# EAGLE design mach (EAGLE 6.1)
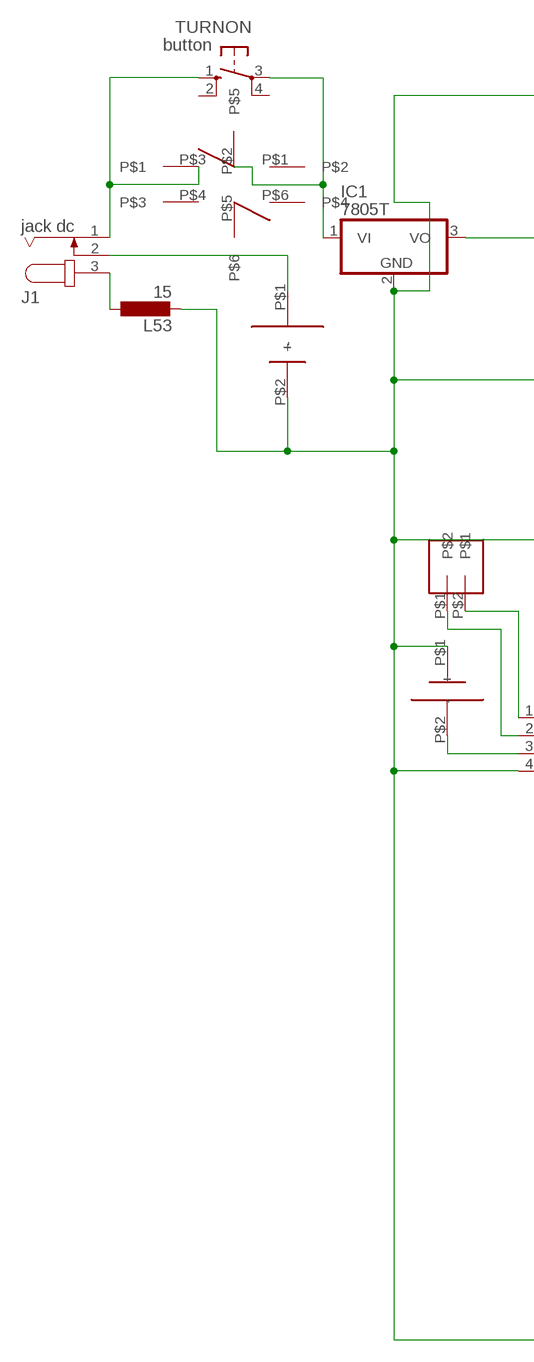
[diagram p0: schematic, sheet 1, part 1 of 2]
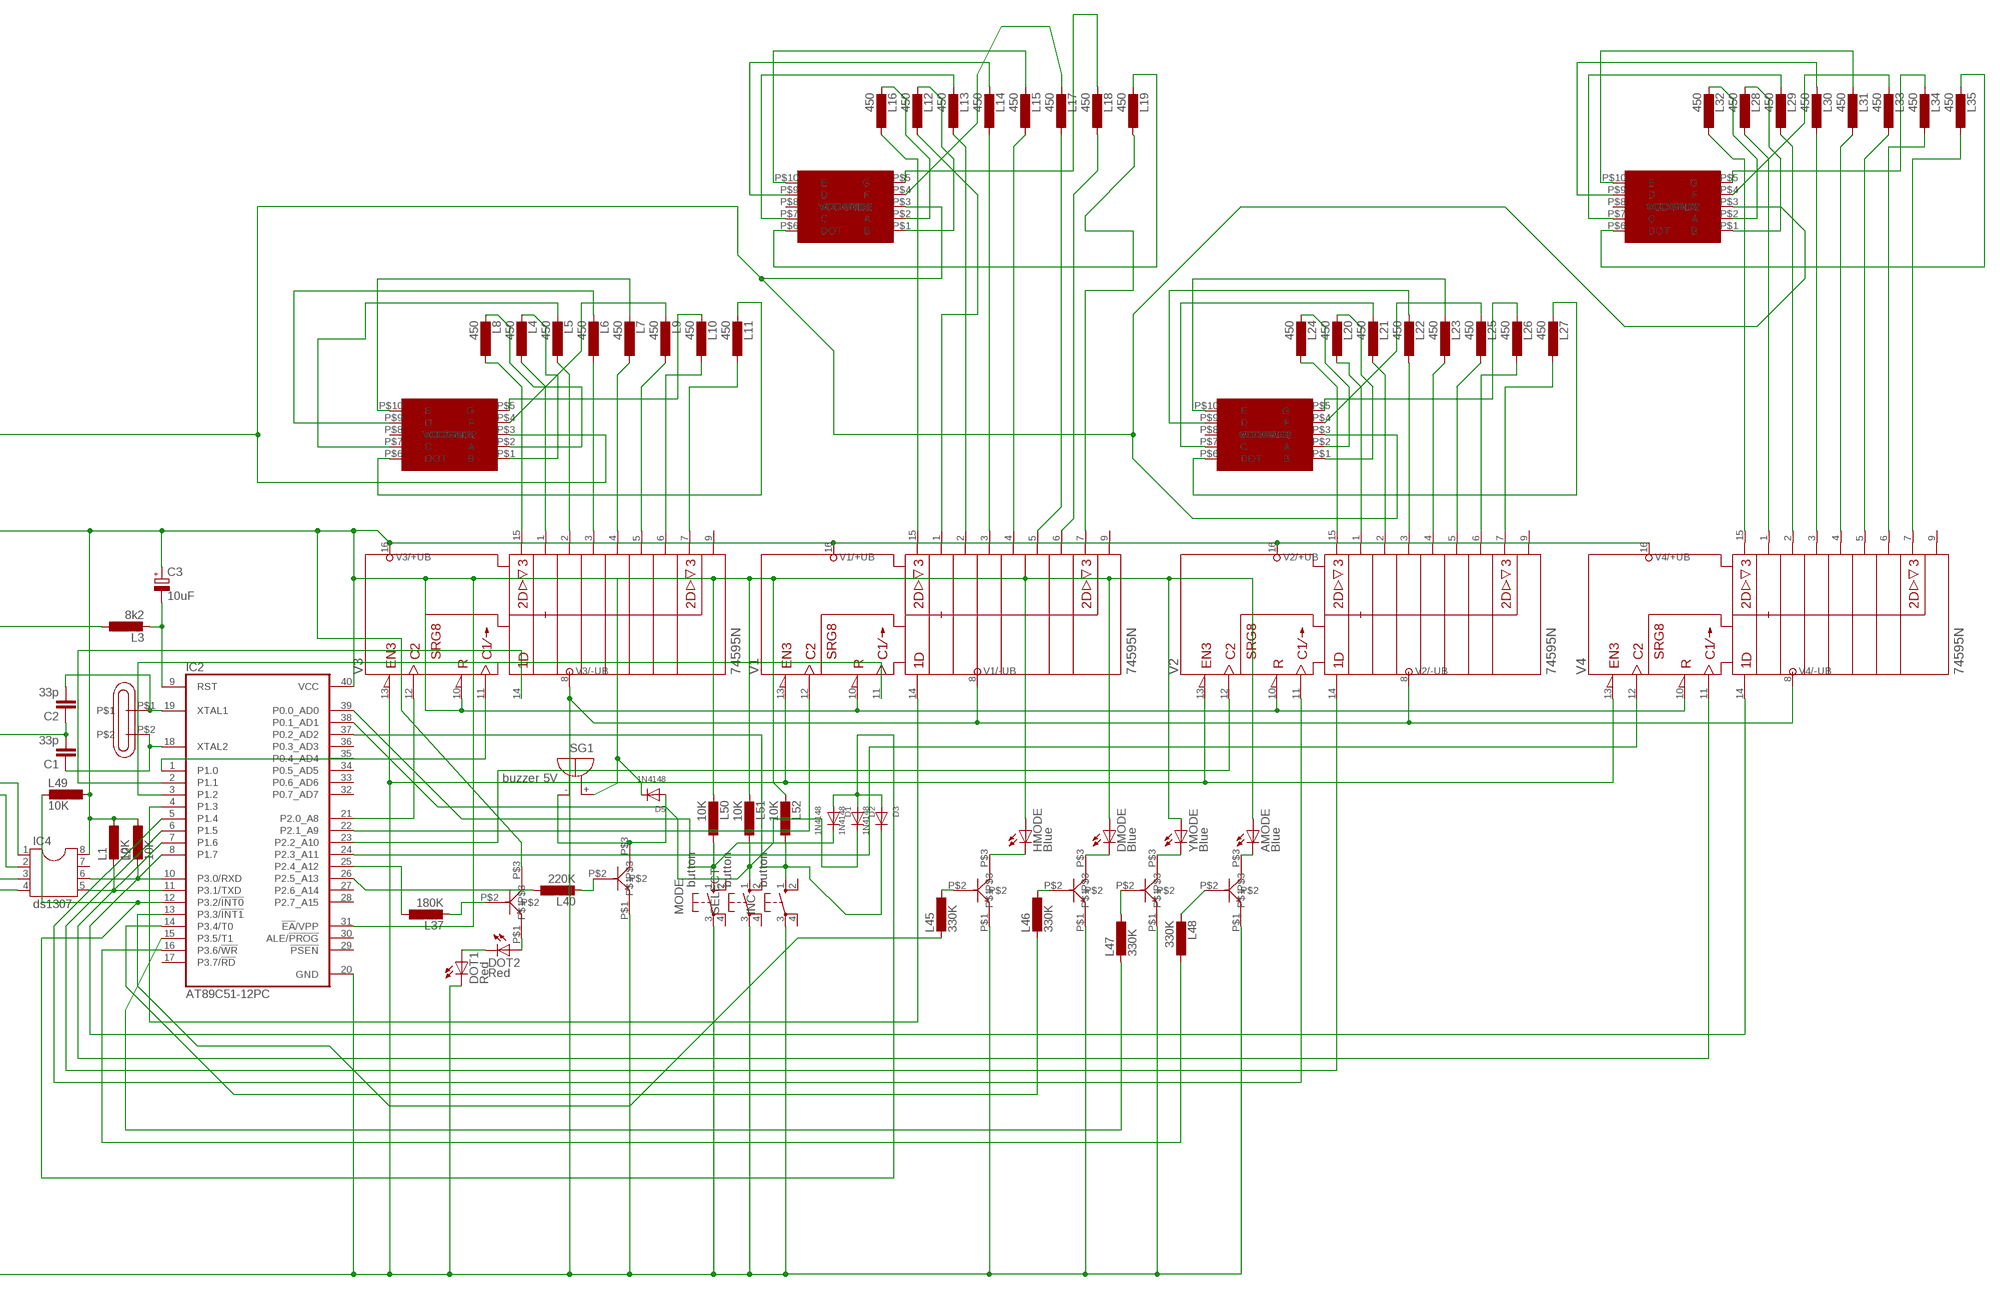
[diagram p1: schematic, sheet 1, part 2 of 2]

## Parts
7SEG1  7SEG13X19 common Katot  7SEG13X19  [7SEG13X19]
7SEG2  7SEG13X19 common Katot  7SEG13X19  [7SEG13X19]
7SEG3  7SEG13X19 common Katot  7SEG13X19  [7SEG13X19]
7SEG4  7SEG13X19 common Katot  7SEG13X19  [7SEG13X19]
AMODE  Blue  LED5MM  [LED5MM]
C1  33p  C5/3  [C5B3]
C2  33p  C5/3  [C5B3]
C3  10uF  CPOL-EUE2-5  [E2-5]
D1  1N4148  DIODEDO-1N4148  [DO-1N4148]
D2  1N4148  DIODEDO-1N4148  [DO-1N4148]
D3  1N4148  DIODEDO-1N4148  [DO-1N4148]
D5  1N4148  DIODEDO-1N4148  [DO-1N4148]
DMODE  Blue  LED5MM  [LED5MM]
DOT1  Red  LED5MM  [LED5MM]
DOT2  Red  LED5MM  [LED5MM]
HMODE  Blue  LED5MM  [LED5MM]
IC1  7805T  [TO220H]
IC2  AT89C51-12PC  [DIL40]
IC4  ds1307  DIL8  [DIL08]
INC  button  10-XX  [B3F-10XX]
J1  jack dc  JACK-PLUG0  [SPC4077]
L1  10K  L-EU0207/10  [0207/10]
L2  10K  L-EU0207/10  [0207/10]
L3  8k2  L-EU0207/10  [0207/10]
L4  450  L-EU0207/10  [0207/10]
L5  450  L-EU0207/10  [0207/10]
L6  450  L-EU0207/10  [0207/10]
L7  450  L-EU0207/10  [0207/10]
L8  450  L-EU0207/10  [0207/10]
L9  450  L-EU0207/10  [0207/10]
L10  450  L-EU0207/10  [0207/10]
L11  450  L-EU0207/10  [0207/10]
L12  450  L-EU0207/10  [0207/10]
L13  450  L-EU0207/10  [0207/10]
L14  450  L-EU0207/10  [0207/10]
L15  450  L-EU0207/10  [0207/10]
L16  450  L-EU0207/10  [0207/10]
L17  450  L-EU0207/10  [0207/10]
L18  450  L-EU0207/10  [0207/10]
L19  450  L-EU0207/10  [0207/10]
L20  450  L-EU0207/10  [0207/10]
L21  450  L-EU0207/10  [0207/10]
L22  450  L-EU0207/10  [0207/10]
L23  450  L-EU0207/10  [0207/10]
L24  450  L-EU0207/10  [0207/10]
L25  450  L-EU0207/10  [0207/10]
L26  450  L-EU0207/10  [0207/10]
L27  450  L-EU0207/10  [0207/10]
L28  450  L-EU0207/10  [0207/10]
L29  450  L-EU0207/10  [0207/10]
L30  450  L-EU0207/10  [0207/10]
L31  450  L-EU0207/10  [0207/10]
L32  450  L-EU0207/10  [0207/10]
L33  450  L-EU0207/10  [0207/10]
L34  450  L-EU0207/10  [0207/10]
L35  450  L-EU0207/10  [0207/10]
L37  180K  L-EU0207/10  [0207/10]
L40  220K  L-EU0207/10  [0207/10]
L45  330K  L-EU0207/10  [0207/10]
L46  330K  L-EU0207/10  [0207/10]
L47  330K  L-EU0207/10  [0207/10]
L48  330K  L-EU0207/10  [0207/10]
L49  10K  L-EU0207/10  [0207/10]
L50  10K  L-EU0207/10  [0207/10]
L51  10K  L-EU0207/10  [0207/10]
L52  10K  L-EU0207/10  [0207/10]
L53  15  L-EU0207/10  [0207/10]
MODE  button  10-XX  [B3F-10XX]
SELECT  button  10-XX  [B3F-10XX]
SG1  buzzer 5V  BMT1205XH7.5  [BMT1205XH7.5]
TURNON  button  10-XX  [B3F-10XX]
U$1  PINCMOS3VCR23  [PINCMOS3VCR23]
U$2  XTAL32KHZMINI  [XTAL32KHZMINI]
U$5  XTAL12MHZ  [XTAL12MHZ]
U$7  lock button down  PUSHLOCKBUTON  [PUSKLOCKBUTTON]
U$8  C9014  [C9014]
U$9  C9014  [C9014]
U$10  C9014  [C9014]
U$11  C9014  [C9014]
U$12  C9014  [C9014]
U$13  C9014  [C9014]
U$14  9V  9VBATERYJACK  [9VBATERYJACK]
V1  74595N  [DIL16]
V2  74595N  [DIL16]
V3  74595N  [DIL16]
V4  74595N  [DIL16]
YMODE  Blue  LED5MM  [LED5MM]

## Nets
ET: J1.2 U$14.P$1(+)
GND: 7SEG1.P$3(VCC/GND1) 7SEG2.P$3(VCC/GND1) 7SEG3.P$3(VCC/GND1) 7SEG4.P$3(VCC/GND1) C1.2 C2.1 DOT1.K(C) IC1.2(GND) IC2.20(GND) IC4.4 INC.3(P) L3.1 L53.2 MODE.3(P) SELECT.3(P) U$1.P$1(-) U$8.P$1 U$9.P$1 U$10.P$1 U$11.P$1 U$12.P$1 U$14.P$2(-) V1.8(-UB) V1.13(!G) V2.8(-UB) V2.13(!G) V3.8(-UB) V3.13(!G) V4.8(-UB) V4.13(!G)
N$1: IC2.11(P3.1/TXD) IC4.5 L1.2
N$2: IC2.10(P3.0/RXD) IC4.6 L2.2
N$3: IC4.1 U$2.P$2
N$4: C3.- IC2.9(RST) L3.2
N$5: IC4.3 U$1.P$2(+)
N$6: IC4.2 U$2.P$1
N$7: C2.2 IC2.19(XTAL1) U$5.P$1
N$8: C1.1 IC2.18(XTAL2) U$5.P$2
N$9: D1.C IC2.39(P0.0_AD0) L50.1 MODE.1(S)
N$10: IC2.25(P2.4_A12) L37.1
N$11: IC2.1(P1.0) V3.11(SRCK)
N$12: IC2.2(P1.1) V3.14(SER)
N$13: IC2.3(P1.2) V1.11(SRCK)
N$14: DOT2.A U$13.P$1
N$15: IC2.5(P1.4) V2.11(SRCK)
N$16: 7SEG1.P$4(F) L9.2
N$17: IC2.6(P1.5) V2.14(SER)
N$18: IC2.7(P1.6) V4.11(SRCK)
N$19: IC2.8(P1.7) V4.14(SER)
N$20: L4.1 V3.1(QB)
N$21: L8.1 V3.15(QA)
N$22: 7SEG1.P$10(E) L7.2
N$23: L9.1 V3.5(QF)
N$24: L10.1 V3.6(QG)
N$25: 7SEG1.P$1(B) L4.2
N$26: L11.1 V3.7(QH)
N$27: L6.1 V3.3(QD)
N$28: L7.1 V3.4(QE)
N$29: L5.1 V3.2(QC)
N$30: DOT1.A DOT2.K(C)
N$31: J1.1 TURNON.1(S) U$7.P$3
N$32: 7SEG1.P$5(G) L10.2
N$33: IC2.4(P1.3) V1.14(SER)
N$34: 7SEG1.P$6(DOT) L11.2
N$35: IC1.1(VI) TURNON.3(P) U$7.P$2
N$36: 7SEG2.P$10(E) L15.2
N$37: L13.1 V1.2(QC)
N$38: L14.1 V1.3(QD)
N$39: L15.1 V1.4(QE)
N$41: L17.1 V1.5(QF)
N$42: 7SEG2.P$5(G) L18.2
N$43: L18.1 V1.6(QG)
N$44: L16.1 V1.15(QA)
N$45: 7SEG2.P$2(A) L16.2
N$47: 7SEG2.P$7(C) L13.2
N$48: 7SEG2.P$9(D) L14.2
N$51: 7SEG2.P$6(DOT) L19.2
N$53: L37.2 U$13.P$2
N$54: 7SEG3.P$10(E) L23.2
N$55: L27.1 V2.7(QH)
N$56: L25.1 V2.5(QF)
N$57: L26.1 V2.6(QG)
N$58: 7SEG3.P$6(DOT) L27.2
N$59: L23.1 V2.4(QE)
N$60: L21.1 V2.2(QC)
N$61: L20.1 V2.1(QB)
N$62: L24.1 V2.15(QA)
N$63: 7SEG3.P$2(A) L24.2
N$64: 7SEG3.P$1(B) L20.2
N$65: 7SEG3.P$7(C) L21.2
N$66: 7SEG3.P$9(D) L22.2
N$67: 7SEG3.P$4(F) L25.2
N$68: 7SEG3.P$5(G) L26.2
N$69: L22.1 V2.3(QD)
N$70: 7SEG4.P$10(E) L31.2
N$71: L35.1 V4.7(QH)
N$72: L33.1 V4.5(QF)
N$73: L34.1 V4.6(QG)
N$74: L30.1 V4.3(QD)
N$75: L31.1 V4.4(QE)
N$76: L29.1 V4.2(QC)
N$77: L28.1 V4.1(QB)
N$78: L32.1 V4.15(QA)
N$79: 7SEG4.P$2(A) L32.2
N$80: 7SEG4.P$1(B) L28.2
N$81: 7SEG4.P$7(C) L29.2
N$82: 7SEG4.P$9(D) L30.2
N$83: 7SEG4.P$4(F) L33.2
N$84: 7SEG4.P$5(G) L34.2
N$85: 7SEG4.P$6(DOT) L35.2
N$89: IC2.26(P2.5_A13) L40.1
N$90: L40.2 U$8.P$2
N$91: L45.1 U$10.P$2
N$92: L46.1 U$9.P$2
N$93: L47.1 U$11.P$2
N$94: HMODE.K(C) U$10.P$3
N$95: D5.A SG1.- U$8.P$3
N$96: D3.C IC2.37(P0.2_AD2) INC.1(S) L52.1
N$97: L48.2 U$12.P$2
N$98: AMODE.K(C) U$12.P$3
N$99: U$11.P$3 YMODE.K(C)
N$101: DMODE.K(C) U$9.P$3
N$105: IC2.13(P3.3/!INT1) L45.2
N$106: D1.A D2.A D3.A IC2.12(P3.2/!INT0) L49.2
N$107: IC2.14(P3.4/T0) L46.2
N$108: IC2.15(P3.5/T1) L47.2
N$109: IC2.16(P3.6/!WR) L48.1
N$110: IC2.21(P2.0_A8) V3.12(RCK)
N$111: IC2.22(P2.1_A9) V1.12(RCK)
N$112: IC2.23(P2.2_A10) V2.12(RCK)
N$113: IC2.24(P2.3_A11) V4.12(RCK)
N$115: J1.3 L53.1
N$117: D2.C IC2.38(P0.1_AD1) L51.1 SELECT.1(S)
N$120: 7SEG1.P$2(A) L8.2
N$121: 7SEG1.P$9(D) L6.2
N$123: 7SEG2.P$4(F) L17.2
N$124: 7SEG1.P$7(C) L5.2
N$127: L19.1 V1.7(QH)
N$128: L12.1 V1.1(QB)
N$129: 7SEG2.P$1(B) L12.2
VCC: AMODE.A C3.+ D5.C DMODE.A HMODE.A IC1.3(VO) IC2.31(!EA!/VPP) IC2.40(VCC) IC4.8 L1.1 L2.1 L49.1 L50.2 L51.2 L52.2 SG1.+ U$13.P$3 V1.10(!SRCLR) V1.16(+UB) V2.10(!SRCLR) V2.16(+UB) V3.10(!SRCLR) V3.16(+UB) V4.10(!SRCLR) V4.16(+UB) YMODE.A
Unconnected: 7SEG1.P$8(VCC/GND2) 7SEG2.P$8(VCC/GND2) 7SEG3.P$8(VCC/GND2) 7SEG4.P$8(VCC/GND2) IC2.17(P3.7/!RD) IC2.27(P2.6_A14) IC2.28(P2.7_A15) IC2.29(!PSEN) IC2.30(ALE/!PROG) IC2.32(P0.7_AD7) IC2.33(P0.6_AD6) IC2.34(P0.5_AD5) IC2.35(P0.4_AD4) IC2.36(P0.3_AD3) IC4.7 INC.2(S1) INC.4(P1) MODE.2(S1) MODE.4(P1) SELECT.2(S1) SELECT.4(P1) TURNON.2(S1) TURNON.4(P1) U$7.P$1 U$7.P$4 U$7.P$5 U$7.P$6 V1.9(QH*) V2.9(QH*) V3.9(QH*) V4.9(QH*)

## Library data of the parts
7SEG1-7SEG4 = 7seg13x19:7SEG13X19
AMODE DMODE DOT1 DOT2 HMODE YMODE = led:LED: LED OSRAM: - CHIPLED LG R971, LG N971, LY N971, LG Q971, LY Q971, LO R971, LY R971 LH N974, LH R974 LS Q976, LO Q976, LY Q976 LO Q996 - Hyper CHIPLED LW Q18S LB Q993, LB Q99A, LB R99A - SideLED LS A670, LO A670, LY A670, LG A670, LP A670 LB A673, LV A673, LT A673, LW A673 LH A674 LY A675 LS A676, LA A676, LO A676, LY A676, LW A676 LS A679, LY A679, LG A679 - Hyper Micro SIDELED® LS Y876, LA Y876, LO Y876, LY Y876 LT Y87S - SmartLED LW L88C, LW L88S LB L89C, LB L89S, LG L890 LS L89K, LO L89K, LY L89K LS L896, LA L896, LO L896, LY L896 - TOPLED LS T670, LO T670, LY T670, LG T670, LP T670 LSG T670, LSP T670, LSY T670, LOP T670, LYG T670 LG T671, LOG T671, LSG T671 LB T673, LV T673, LT T673, LW T673 LH T674 LS T676, LA T676, LO T676, LY T676, LB T676, LH T676, LSB T676, LW T676 LB T67C, LV T67C, LT T67C, LS T67K, LO T67K, LY T67K, LW E67C LS E67B, LA E67B, LO E67B, LY E67B, LB E67C, LV E67C, LT E67C LW T67C LS T679, LY T679, LG T679 LS T770, LO T770, LY T770, LG T770, LP T770 LB T773, LV T773, LT T773, LW T773 LH T774 LS E675, LA E675, LY E675, LS T675 LS T776, LA T776, LO T776, LY T776, LB T776 LHGB T686 LT T68C, LB T68C - Hyper Mini TOPLED® LB M676 - Mini TOPLED Santana® LG M470 LS M47K, LO M47K, LY M47K Source: http://www.osram.convergy.de LUXEON: - LUMILED® LXK2-PW12-R00, LXK2-PW12-S00, LXK2-PW14-U00, LXK2-PW14-V00 LXK2-PM12-R00, LXK2-PM12-S00, LXK2-PM14-U00 LXK2-PE12-Q00, LXK2-PE12-R00, LXK2-PE12-S00, LXK2-PE14-T00, LXK2-PE14-U00 LXK2-PB12-K00, LXK2-PB12-L00, LXK2-PB12-M00, LXK2-PB14-N00, LXK2-PB14-P00, LXK2-PB14-Q00 LXK2-PR12-L00, LXK2-PR12-M00, LXK2-PR14-Q00, LXK2-PR14-R00 LXK2-PD12-Q00, LXK2-PD12-R00, LXK2-PD12-S00 LXK2-PH12-R00, LXK2-PH12-S00 LXK2-PL12-P00, LXK2-PL12-Q00, LXK2-PL12-R00 Source: www.luxeon.com KINGBRIGHT: KA-3528ASYC Source: www.kingbright.com
C1 C2 = capacitor-wima:C: CAPACITOR naming: grid - package width
C3 = rcl:CPOL-EU: POLARIZED CAPACITOR, European symbol
D1-D3 D5 = microbuilder:DIODE: Diode SMADIODE - SMA Surface Mount Package 20V 1A Schottky Diode Digikey (500mV @ 1A, 500uA Vr @ 20V): 641-1014-6-ND 10V 2A Schottky Diode Digikey (350mV @ 2A, 700uA Vr @ 10V): MBRA210LT3 SOD-123 30V 200mA (800mV Vf, 2uA Vr @ 25V) Schottky Diode (very fast switching for boost, etc.) - Digikey: BAT54T1GOSTR-ND 30V 500mA (430mV Vf, 130uA Vr @ 30V) Schottky Diode - Digikey: B0530W-FDICT-ND MBR120 1A 20V (0.34Vf) Schottky Diode - Digikey: MBR120VLSFT1GOSCT-ND SOD-323 10V 570mA (380mV Vf, 3ns) Schottky Diode - Digikey: ZLLS410CT-ND 1N4148WS - 75V 150mA (1V Vf @ 10mA, 4ns) Simple Diode - Digikey: 1N4148WSFSCT-ND, Mouser: 512-1N4148WS SOD-523 BAT54 30V 200mA Schottky (0.8 Vf @ 100mA, 5ns) - Digikey: BAT54XV2CT-ND 30V 30mA Schottky Diode (RB751S-40TE61) - Digikey: RB751S-40TE61CT-ND SOT23-R/W - SOT23 Package (R = Solder Paste/Reflow Ovens, W = Hand-Soldering) BAT54Film 40V 300mA - Digikey: 497-7162-1-ND DO-1N4148 Through Hole Small Current Diode (any model)
IC1 = linear:78*: Positive VOLTAGE REGULATOR Source: http://cache.national.com/ds/LM/LM78L05.pdf http://www.fairchildsemi.com/ds/LM/LM7805.pdf
IC2 = atmel:AT89C51-*: 8-bit Microcontroller with 4K Bytes Flash Not Recommended for New Designs. Use AT89S51. Source: http://www.atmel.com/dyn/resources/prod_documents/doc0265.; OC_FARNELL: unknown; OC_NEWARK: unknown
IC4 = ic-package:DIL8: Dual In Line / Socket
INC MODE SELECT TURNON = switch-omron:10-XX: OMRON SWITCH; MPN: B3F-1000; OC_FARNELL: 176432; OC_NEWARK: 36M3542
J1 = con-jack:JACK-PLUG: DC POWER JACK Power Jack, DC, Right Angle, Through Hole, Rated 5A at 16VDC, PC Terminals Distributor: Farnell (www.Farnell.de) Drawing: 84N1161.pdf / 84N1162.pdf Manufacturer: SPC Technology (www.spctechnology.com) Type: SPC4077 / SPC 4078; OC_FARNELL: unknown; OC_NEWARK: unknown
L1-L35 L37 L40 L45-L53 = resistor:L-EU: INDUCTOR, European symbol
SG1 = buzzer:BMT1205XH7.5: MAGNETIC TRANSDUCER Source: Http:www.be-star.com; OC_FARNELL: unknown; OC_NEWARK: unknown
U$1 = PINCMOS3VCR23:PINCMOS3VCR23
U$2 = Xtal32khzmini:XTAL32KHZMINI
U$5 = xtal12mhz:XTAL12MHZ
U$7 = pushlockbutton:PUSHLOCKBUTON
U$8-U$13 = C9014:C9014
U$14 = 9vbateryjack:9VBATERYJACK
V1-V4 = 74ttl-din:74*595: 8-bit SHIFT REGISTER, output latch

## Board
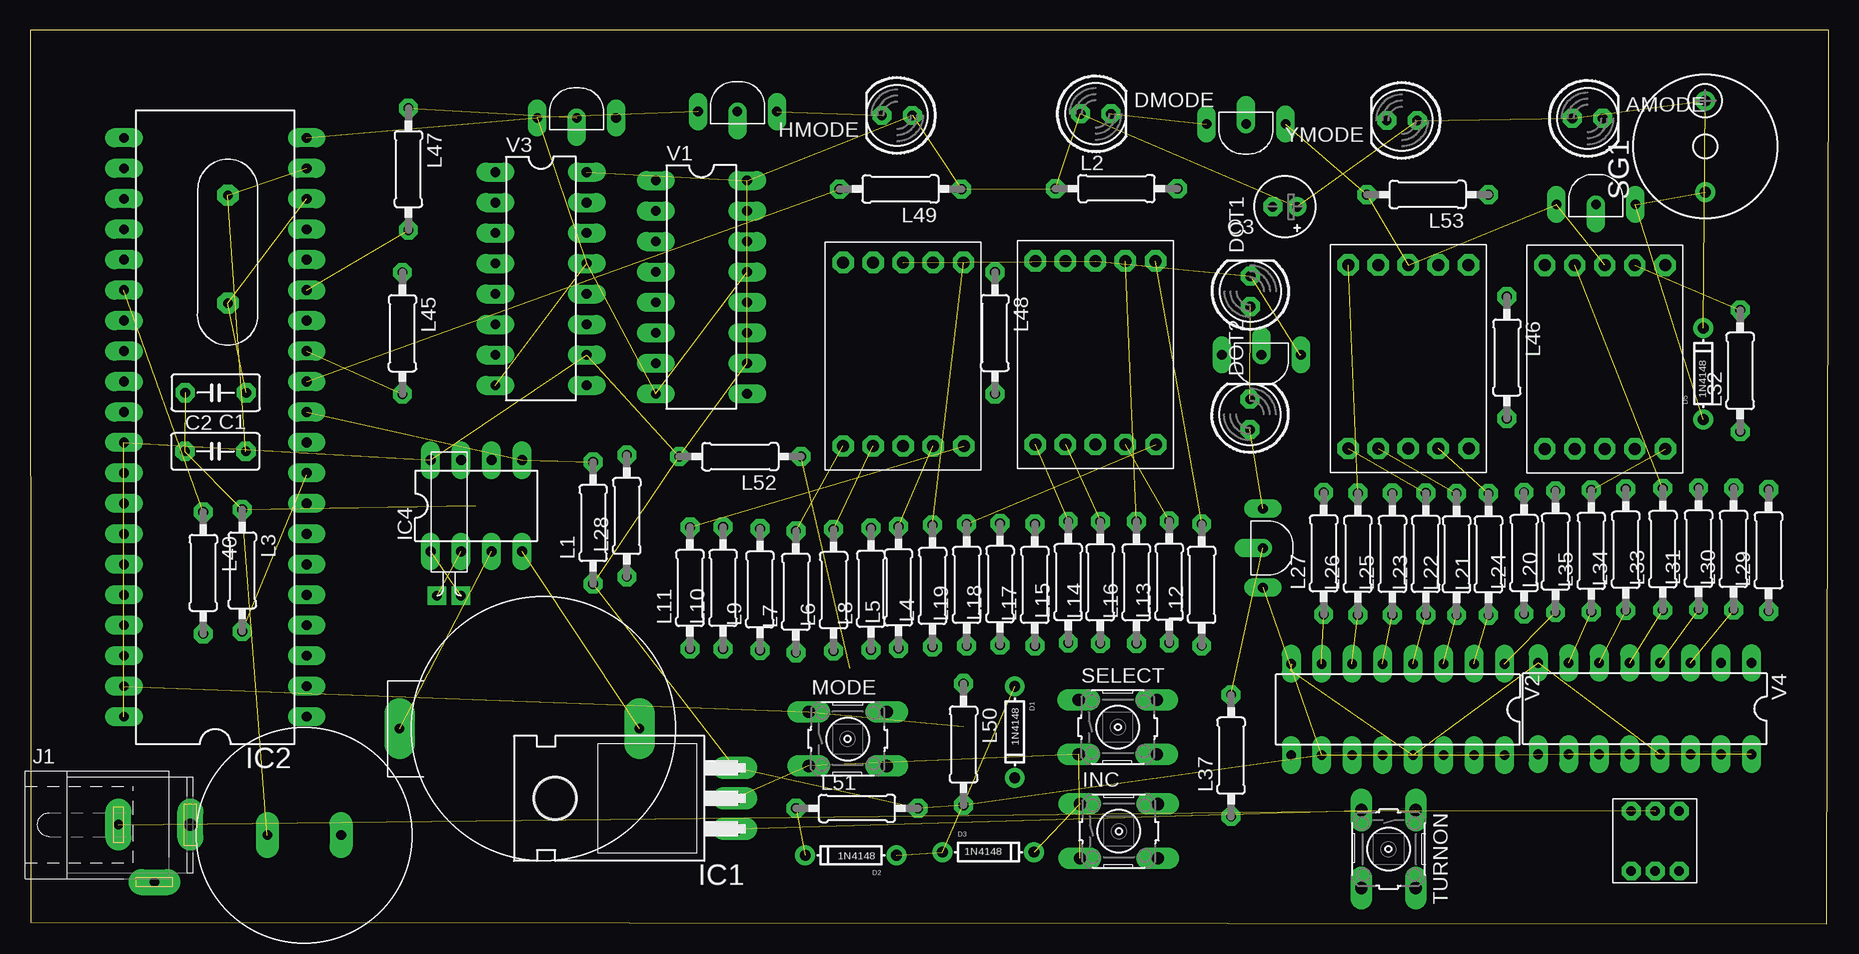
[diagram p2: board, top side]
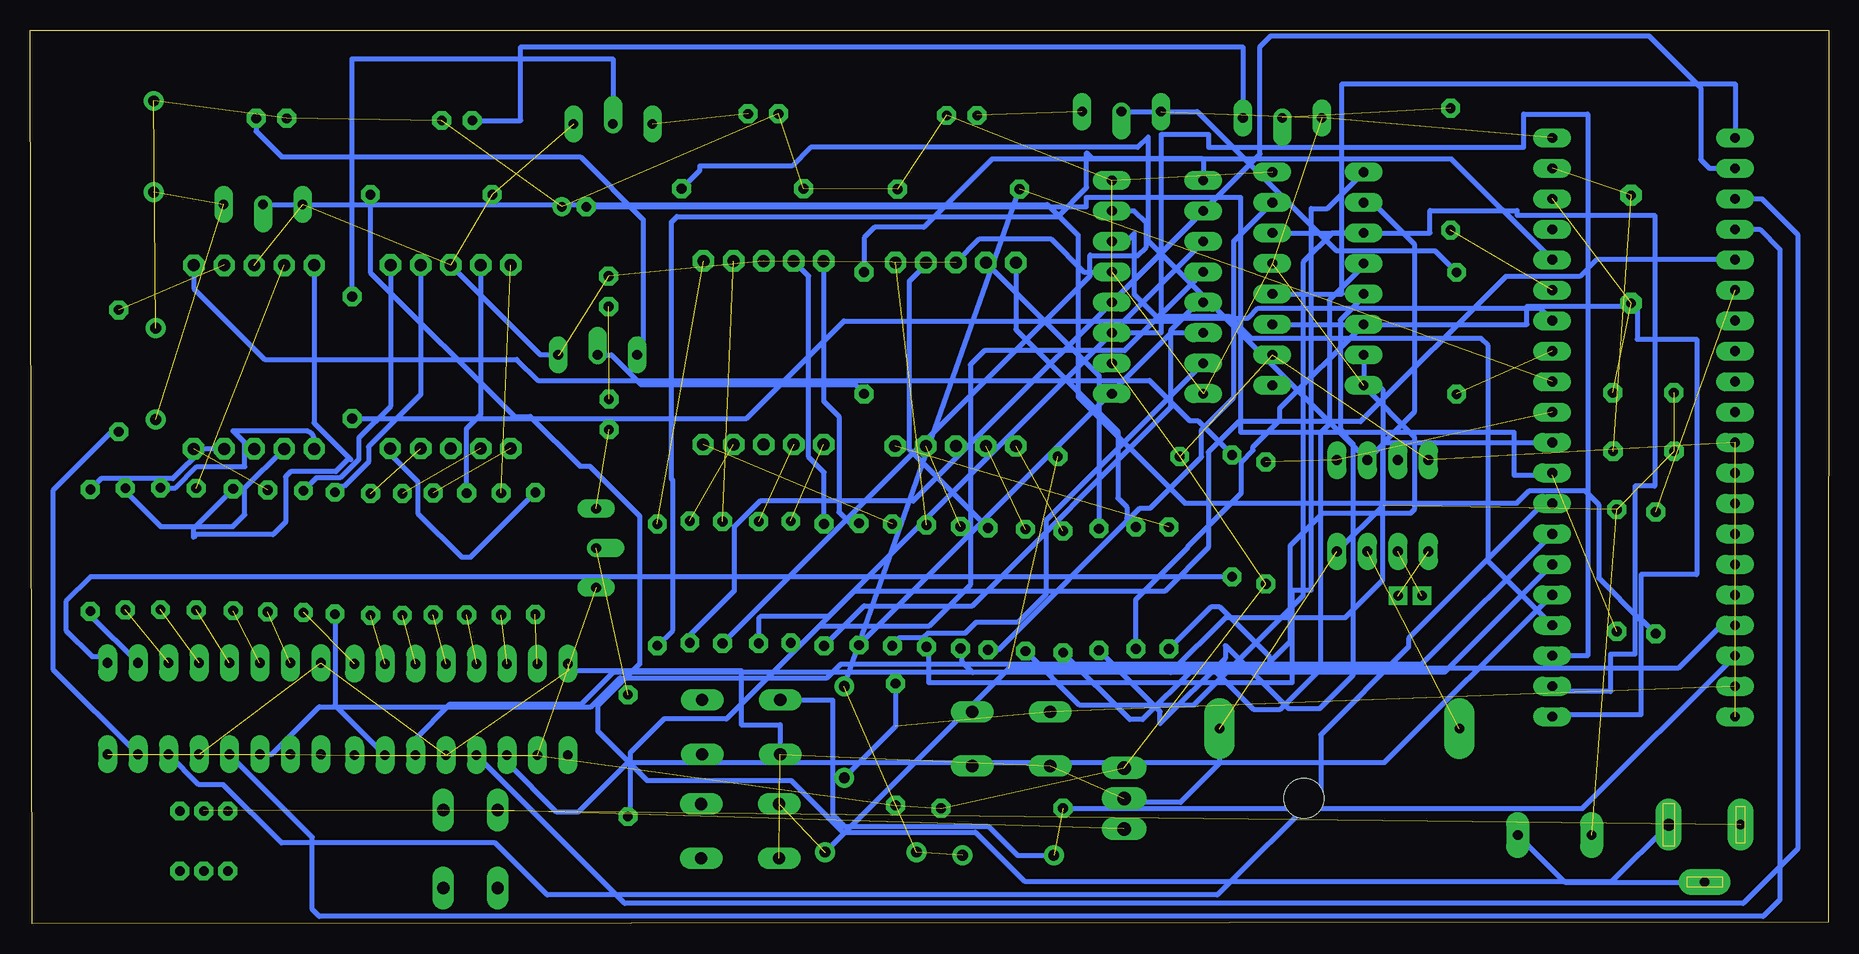
[diagram p3: board, bottom side, seen from below]

Size 149.96 x 74.51 mm. Coordinates in mm from the lower left corner, seen from the top.
Outline: 0.05,0.1 149.75,0 149.96,74.49 0,74.51 0.05,0.1
Copper layers (1*16): Top 0.035mm / dielectric 1.5mm / Bottom 0.035mm
Design rules: minimum track width 20mil, minimum drill 20mil, track to track 15mil, track to pad 15mil, pad to pad 15mil, via to via 15mil, smd to smd 8mil, copper to edge 0mil, drill to drill 20mil, minimum pad ring 15mil, minimum via ring 8mil, stop-mask expansion 10mil, vias tented up to drill 0mil, thermal gap 40mil

### Footprints (pad centres in the part's own frame; a part is rotated, then mirrored left to right if it is on the bottom)
7SEG13X19 = drill 1 pad 1.778 octagon: P$1 5.175,7.19; P$2 2.65,7.19; P$3 0.15,7.19; P$4 -2.35,7.19; P$5 -4.85,7.19; P$6 5.201,-8.11; P$7 2.65,-8.11; P$8 0.15,-8.11; P$9 -2.35,-8.11; P$10 -4.85,-8.11
LED5MM = drill 0.813 octagon: A -1.27,0; K 1.27,0
C5B3 = drill 0.813 pad 1.6 octagon: 1 -2.54,0; 2 2.54,0
E2-5 = drill 0.813 pad 1.27: + -1.016,0 | drill 0.813 pad 1.27 octagon: - 1.016,0
DO-1N4148 = drill 0.9: A -3.81,0; C 3.81,0
TO220H = drill 1.118 long: 1 -2.54,-10.16; 2 0,-10.16; 3 2.54,-10.16 | hole 3.302: 0,4.826
DIL40 = drill 0.813 long: 1 -24.13,-7.62; 2 -21.59,-7.62; 3 -19.05,-7.62; 4 -16.51,-7.62; 5 -13.97,-7.62; 6 -11.43,-7.62; 7 -8.89,-7.62; 8 -6.35,-7.62; 9 -3.81,-7.62; 10 -1.27,-7.62; 11 1.27,-7.62; 12 3.81,-7.62; 13 6.35,-7.62; 14 8.89,-7.62; 15 11.43,-7.62; 16 13.97,-7.62; 17 16.51,-7.62; 18 19.05,-7.62; 19 21.59,-7.62; 20 24.13,-7.62; 21 24.13,7.62; 22 21.59,7.62; 23 19.05,7.62; 24 16.51,7.62; 25 13.97,7.62; 26 11.43,7.62; 27 8.89,7.62; 28 6.35,7.62; 29 3.81,7.62; 30 1.27,7.62; 31 -1.27,7.62; 32 -3.81,7.62; 33 -6.35,7.62; 34 -8.89,7.62; 35 -11.43,7.62; 36 -13.97,7.62; 37 -16.51,7.62; 38 -19.05,7.62; 39 -21.59,7.62; 40 -24.13,7.62
DIL08 = drill 0.813 long: 1 -3.81,-3.81; 2 -1.27,-3.81; 3 1.27,-3.81; 4 3.81,-3.81; 5 3.81,3.81; 6 1.27,3.81; 7 -1.27,3.81; 8 -3.81,3.81
B3F-10XX = drill 1.016 long: 1 -3.251,2.261; 2 3.251,2.261; 3 -3.251,-2.261; 4 3.251,-2.261
SPC4077 = drill 0.8 pad 2.184 long: 1 -3,0; 2 0,-4.8 | drill 1 pad 2.184 long: 3 3,0
0207/10 = drill 0.813 octagon: 1 -5.08,0; 2 5.08,0
BMT1205XH7.5 = drill 0.9 pad 1.5: + 3.8,0; - -3.8,0
PINCMOS3VCR23 = drill 0.8 pad 2.54 long: P$1 0,8; P$2 0,-12
XTAL32KHZMINI = drill 0.8 square: P$1 0.5,-12; P$2 2.5,-12
XTAL12MHZ = drill 0.8 pad 1.778 octagon: P$1 9.5,-2.5; P$2 0.5,-2.5
PUSKLOCKBUTTON = drill 0.8 pad 1.422 octagon: P$1 5.04,0; P$2 3.04,0; P$3 1.04,0; P$4 1.04,-5; P$5 3.04,-5; P$6 5.04,-5
C9014 = drill 0.8 long: P$1 -1.04,1; P$3 5.54,1 | drill 0.8 offset: P$2 2.25,1
9VBATERYJACK = drill 0.8 pad 1.93 long: P$1 -3.08,0; P$2 3.08,0
DIL16 = drill 0.813 long: 1 -8.89,-3.81; 2 -6.35,-3.81; 3 -3.81,-3.81; 4 -1.27,-3.81; 5 1.27,-3.81; 6 3.81,-3.81; 7 6.35,-3.81; 8 8.89,-3.81; 9 8.89,3.81; 10 6.35,3.81; 11 3.81,3.81; 12 1.27,3.81; 13 -1.27,3.81; 14 -3.81,3.81; 15 -6.35,3.81; 16 -8.89,3.81

### Placement (x,y rotation side)
7SEG1  72.64,47.93 0 top
7SEG2  88.65,48.06 0 top
7SEG3  114.74,47.72 0 top
7SEG4  131.12,47.7 0 top
AMODE  129.84,67.14 0 top
C1  15.48,44.26 180 top
C2  15.46,39.37 0 top
C3  104.61,59.77 180 top
D1  82.08,15.97 270 top
D2  68.43,5.69 180 top
D3  79.88,5.96 0 top
D5  139.47,45.85 90 top
DMODE  88.83,67.52 0 top
DOT1  101.73,52.72 90 top
DOT2  101.7,42.45 90 top
HMODE  72.28,67.38 180 top
IC1  48.6,10.44 90 top
IC2  15.45,41.38 90 top
IC4  37.2,34.83 0 top
INC  90.76,7.7 0 top
J1  10.37,8.25 0 top
L1  46.94,33.4 90 top
L2  90.57,61.28 0 top
L3  17.69,29.44 270 top
L4  75.24,28.16 90 top
L5  72.39,28.03 90 top
L6  66.99,27.8 90 top
L7  63.84,27.66 90 top
L8  70.1,27.91 90 top
L9  60.85,27.85 90 top
L10  57.77,27.98 90 top
L11  55.01,27.98 90 top
L12  97.67,28.25 90 top
L13  94.96,28.49 90 top
L14  89.21,28.45 90 top
L15  86.54,28.47 90 top
L16  92.22,28.45 90 top
L17  83.76,28.24 90 top
L18  80.86,28.3 90 top
L19  78.08,28.24 90 top
L20  127.16,31.01 90 top
L21  121.58,30.79 90 top
L22  118.91,30.79 90 top
L23  116.35,30.81 90 top
L24  124.54,30.89 90 top
L25  113.57,30.81 90 top
L26  110.68,30.81 90 top
L27  107.84,30.87 90 top
L28  49.75,33.99 90 top
L29  144.92,31.12 90 top
L30  142.01,31.23 90 top
L31  139.09,31.25 90 top
L32  142.55,46.09 90 top
L33  136.11,31.22 90 top
L34  133.01,31.17 90 top
L35  130.14,31.07 90 top
L37  100.12,14 90 top
L40  14.44,29.25 270 top
L45  31.04,49.22 270 top
L46  123.11,47.19 270 top
L47  31.54,62.9 270 top
L48  80.43,49.24 270 top
L49  72.56,61.24 180 top
L50  77.82,14.93 270 top
L51  68.93,9.61 0 top
L52  59.2,38.94 180 top
L53  116.5,60.78 180 top
MODE  68.16,15.4 0 top
SELECT  90.68,16.38 0 top
SG1  139.65,64.79 90 top
TURNON  113.24,6.21 270 top
U$1  42.8,16.24 270 top
U$2  33.42,39.34 0 top
U$5  14,51.23 90 top
U$7  132.43,9.39 0 top
U$8  128.28,58.96 0 top
U$9  103.61,67.67 180 top
U$10  56.72,66.7 0 top
U$11  43.32,66.18 0 top
U$12  104.9,48.42 180 top
U$13  101.77,33.56 270 top
U$14  22.86,7.38 180 top
V1  55.97,53.07 270 top
V2  114.02,17.85 180 top
V3  42.59,53.77 270 top
V4  134.6,17.93 180 top
YMODE  114.36,66.96 180 top

### Tracks (layer width: path | path; a pad name or v marks a point on that pad's centre or on a via)
ET
  Bottom 0.406: U$14.P$1 22.01,3.45 J1.2
GND  (26 unrouted)
  Bottom 0.406: U$1.P$1 50.8,13.35 54.05,10.1 58.42,10.1 IC1.2 | 7SEG1.P$3 70.81,57.1 64.87,57.1 62.12,54.34 V1.13 | IC4.4 37.16,34.87 37.16,44.45 37.6,44.88 V3.8 | 105.05,21.1 90.68,21.1 90.68,16.59 87.42,16.59 SELECT.3 | 105.87,47.42 107.4,47.42 7SEG3.P$3
N$1  (2 unrouted)
N$2
  Bottom 0.406: IC2.10 37,40.11 IC4.6 56.75,56.92 56.75,65.58 57.61,64.72 84.89,64.72 86.44,63.17 94.14,63.17 94.14,62.79 L2.2
N$3  (1 unrouted)
N$4  (1 unrouted)
  Bottom 0.406: C3.- 61.9,59.77 61.9,60.55 49.05,60.55 49.05,40.97 26.27,40.97 26.27,37.39 23.07,37.39 IC2.9
N$5  (1 unrouted)
N$6  (1 unrouted)
N$7  (2 unrouted)
N$8  (2 unrouted)
N$9  (2 unrouted)
  Bottom 0.406: L50.1 77.82,16.43 D1.C
N$10
  Bottom 0.406: IC2.25 19.38,55.35 20.78,53.95 26.95,53.95 39.04,41.86 49.2,41.86 51.74,39.32 51.74,31.34 55.37,27.71 81.26,27.71 91.9,17.07 97.11,17.07 99.93,14.25 99.93,9.12 L37.1
N$11
  Bottom 0.406: V3.11 25.17,49.96 25.17,51.48 15.98,51.48 15.98,48.72 11.03,48.72 11.03,29.11 15.67,29.11 15.67,17.42 23.07,17.42 IC2.1
N$12
  Bottom 0.406: V3.14 33.25,57.58 33.25,59.46 26.01,59.46 26.01,59.05 14.53,59.05 14.53,36.47 16.18,36.47 16.18,22.45 18.21,22.45 18.21,19.35 23.07,19.35 IC2.2
N$13
  Bottom 0.406: V1.11 55.65,49.26 55.65,65.81 51.72,65.81 51.72,64.72 25.45,64.72 25.45,67.49 20.12,67.49 20.12,22.33 IC2.3
N$14  (1 unrouted)
N$15
  Bottom 0.406: V2.11 110.21,13.43 106.1,9.32 104.22,9.32 100.1,13.44 37.04,13.44 IC2.5
N$16
  Bottom 0.406: 7SEG1.P$4 60.85,45.68 L9.2
N$17
  Bottom 0.406: V2.14 117.83,15.42 114.94,18.31 103.96,18.31 101.3,20.98 32.04,20.98 IC2.6
N$18
  Bottom 0.406: V4.11 129.8,14.12 125.83,18.08 103.18,18.08 100.76,20.5 83.52,20.5 82.37,21.64 33.92,21.64 IC2.7
N$19
  Bottom 0.406: IC2.8 23.8,35.03 35.05,23.77 35.05,23.06 42.37,15.75 42.37,11 50.98,2.39 106.84,2.39 111.18,6.73 128.98,6.73 133.84,11.58 135.88,11.58 V4.14
N$20
  Bottom 0.406: L4.1 75.06,23.08 75.06,20.09 44.73,20.09 44.73,27.81 43.16,27.81 43.16,59.61 41.83,59.61 V3.1
N$21
  Bottom 0.406: L8.1 69.25,22.83 57.43,34.64 56.57,34.64 52.3,38.91 52.3,41.17 49.61,43.86 49.61,56.92 V3.15
N$22  (1 unrouted)
N$23
  Bottom 0.406: V3.5 38.78,52.28 40.74,50.32 40.74,41.25 40.26,40.77 40.26,40.59 39.68,40 39.68,20.7 42.47,17.91 45.04,17.91 50.32,23.19 50.32,22.12 55.76,16.69 55.76,17.68 L9.1
N$24
  Bottom 0.406: L10.1 57.77,27.01 53.44,31.34 53.44,31.44 49,35.89 49,38.45 48.01,39.45 48.01,39.75 45.77,41.98 45.77,42.97 V3.6
N$25  (1 unrouted)
N$26
  Bottom 0.406: V3.7 38.78,44.8 34.57,40.59 34.57,34.52 34.88,34.21 42.22,34.21 44.94,31.49 44.94,23.49 46.61,21.82 46.61,22.22 50.78,26.39 51.52,26.39 L11.1
N$27
  Bottom 0.406: V3.3 41.4,57.58 43.84,55.14 43.84,27.33 52.96,18.21 62.48,18.21 L6.1
N$28
  Bottom 0.406: V3.4 38.78,54.84 41.66,51.97 41.66,41.65 42.4,40.92 42.4,21.21 45.77,17.83 47.93,17.83 51.31,21.21 53.04,21.21 57.23,17.02 58.27,17.02 L7.1
N$29
  Bottom 0.406: V3.2 38.03,60.12 34.57,56.67 34.57,42.65 37.21,40 37.21,28.62 40.34,25.5 50.32,25.5 54.89,20.93 71.38,20.93 72.27,21.82 72.27,22.82 L5.1
N$30  (1 unrouted)
N$31  (2 unrouted)
N$32
  Bottom 0.406: 7SEG1.P$5 67.79,49.55 59.29,41.05 59.29,35.48 58.52,34.72 58.52,33.81 L10.2
N$33
  Bottom 0.406: IC2.4 28.4,30.21 28.4,48.18 29.01,48.79 48.16,48.79 49.96,50.59 56.06,50.59 57.91,52.45 57.91,57.53 58.56,56.88 V1.14
N$34  (1 unrouted)
N$35  (2 unrouted)
N$36  (1 unrouted)
N$37
  Bottom 0.406: V1.2 76.35,35.23 89.11,35.23 91.26,33.07 91.26,27.74 94.96,24.04 L13.1
N$38
  Bottom 0.406: V1.3 83.41,25.63 89.06,25.63 89.21,25.47 L14.1
N$39
  Bottom 0.406: V1.4 58.72,47.78 70.41,47.78 71.58,46.61 71.58,28.24 75.03,24.79 84.18,24.79 85.57,23.39 L15.1
N$41
  Bottom 0.406: L17.1 80.43,26.49 71.4,26.49 54.84,43.05 54.84,49.5 52.55,51.8 V1.5
N$42
  Bottom 0.406: 7SEG2.P$5 83.8,43.56 82.53,42.29 82.53,34.31 81.1,32.89 81.1,33.13 L18.2
N$43
  Bottom 0.406: L18.1 54.81,49.26 V1.6
N$44
  Bottom 0.406: L16.1 61.6,53.99 61.6,55.75 61.52,55.68 57.64,55.68 56.9,56.41 56.9,58.39 57.92,59.42 V1.15
N$45  (1 unrouted)
N$47  (1 unrouted)
N$48  (1 unrouted)
N$51  (1 unrouted)
N$53  (1 unrouted)
N$54  (1 unrouted)
N$55  (1 unrouted)
N$56  (1 unrouted)
N$57  (1 unrouted)
N$58
  Bottom 0.406: 7SEG3.P$6 119.94,39.16 117.63,36.85 117.63,34.21 113.97,30.55 113.23,30.55 L27.2
N$59  (1 unrouted)
N$60  (1 unrouted)
N$61  (1 unrouted)
N$62
  Bottom 0.406: L24.1 124.54,18.21 V2.15
N$63
  Bottom 0.406: 7SEG3.P$2 117.39,44.13 121.74,39.77 121.74,38.48 123.78,36.45 124.06,36.45 L24.2
N$64
  Bottom 0.406: 7SEG3.P$1 119.91,43.13 122.56,40.49 122.56,38.71 124.11,37.16 126.1,37.16 L20.2
N$65  (1 unrouted)
N$66  (1 unrouted)
N$67
  Bottom 0.406: 7SEG3.P$4 112.39,42.45 113.59,41.25 113.59,35.92 L25.2
N$68  (1 unrouted)
N$69  (1 unrouted)
N$70
  Bottom 0.406: L31.2 137.82,36.33 136.05,38.1 132.05,38.1 132.05,40.1 133.05,41.1 127.05,41.1 arc90 126.27,40.32 7SEG4.P$10
N$71  (1 unrouted)
N$72  (1 unrouted)
N$73  (1 unrouted)
N$74  (1 unrouted)
N$75  (1 unrouted)
N$76
  Bottom 0.406: L29.1 144.92,25.71 V4.2
N$77
  Bottom 0.406: L28.1 144.91,28.9 146.97,26.85 146.97,24.46 144.78,22.27 143.39,22.27 | 143.39,22.27 143.31,22.27 | V4.1 143.67,21.56 143.69,21.56 143.39,21.87 143.39,22.27
N$78
  Bottom 0.406: L32.1 143.15,41.01 148.05,36.1 148.05,21.21 V4.15
N$79  (1 unrouted)
N$80
  Bottom 0.406: 7SEG4.P$1 136.3,52.96 130.38,47.04 109.38,47.04 107.62,45.29 56.64,45.29 53.29,41.93 52.61,41.93 L28.2
N$81
  Bottom 0.406: 7SEG4.P$7 135.57,39.59 138.05,37.1 144.02,37.1 L29.2
N$82
  Bottom 0.406: L30.2 142.01,36.05 139.05,33.1 133.05,33.1 132.05,34.1 132.05,36.31 7SEG4.P$9
N$83  (1 unrouted)
N$84
  Bottom 0.406: 7SEG4.P$5 126.27,41.74 123.22,38.68 123.47,38.68 124.46,37.69 128.22,37.69 128.65,37.26 128.65,33.48 129.7,32.43 136.1,32.43 136.32,32.21 136.32,32.94 L34.2
N$85  (1 unrouted)
N$89  (1 unrouted)
N$90
  Bottom 0.406: U$8.P$2 65.15,59.96 62.59,57.4 62.59,43.94 53.7,35.05 26.01,35.05 24.97,36.09 20.37,36.09 19.21,34.92 19.21,28.8 15.7,25.3 15.58,25.3 L40.2
N$91
  Bottom 0.406: U$10.P$2 52.65,67.7 41.05,56.1 32.85,56.1 L45.1
N$92
  Bottom 0.406: L46.1 123.11,72.1 101.36,72.1 U$9.P$2
N$93  (1 unrouted)
N$94  (1 unrouted)
N$95  (2 unrouted)
N$96  (2 unrouted)
  Bottom 0.406: IC2.37 8.99,24.87 12.58,21.28 68.37,21.28 D3.C
N$97
  Bottom 0.406: U$12.P$2 101.5,47.42 99.01,44.93 81.2,44.93 L48.2
N$98
  Bottom 0.406: AMODE.K 131.11,66.06 128.98,63.93 104.07,63.93 98.83,58.7 98.83,47.94 U$12.P$3
N$99
  Bottom 0.406: YMODE.K 109.05,66.96 109.05,73.1 48.86,73.1 U$11.P$3
N$101  (1 unrouted)
N$105  (1 unrouted)
N$106  (3 unrouted)
  Bottom 0.406: D1.A L49.2
N$107
  Bottom 0.406: L46.2 90.25,42.11 82.12,50.24 54.18,50.24 53.93,50.49 48.42,50.49 47.6,51.31 24.1,51.31 IC2.14
N$108  (1 unrouted)
N$109
  Bottom 0.406: IC2.16 31.47,63.75 69.75,63.75 75.44,58.06 79.56,58.06 80.43,57.19 L48.1
N$110
  Bottom 0.406: V3.12 40.59,52.5 40.59,70.03 7.83,70.03 IC2.21
N$111
  Bottom 0.406: V1.12 47.42,64.16 47.42,73.12 46.54,74.01 15.01,74.01 10.7,69.7 10.7,63.7 9.97,62.97 IC2.22
N$112
  Bottom 0.406: IC2.23 5.6,60.43 2.62,57.45 2.62,6.22 7.17,1.68 100.38,1.68 V2.12
N$113
  Bottom 0.406: IC2.24 5.78,57.89 4.09,56.21 4.09,2 5.49,0.61 125.83,0.61 126.42,1.19 126.42,7.2 V4.12
N$115
  Bottom 0.406: L53.1 121.59,54.3 109.58,42.29 108.26,42.29 104.12,38.15 103.3,38.15 99.14,33.98 99.14,21.64 102.64,18.13 102.64,16.05 98.53,11.94 86.52,11.94 82.2,7.62 71.15,7.62 67.06,3.53 18.1,3.53 J1.3
N$117  (1 unrouted)
  Bottom 0.406: SELECT.1 83.05,18.64 83.05,9.1 82.05,8.1 70.05,8.1 67.64,5.69 D2.C | L51.1 20.55,9.61 IC2.38
N$120
  Bottom 0.406: L8.2 76.66,39.55 76.66,53.57 75.29,54.94 7SEG1.P$2
N$121  (1 unrouted)
N$123
  Bottom 0.406: L17.2 83.76,37.63 85.04,38.91 85.04,53.99 7SEG2.P$4
N$124  (1 unrouted)
N$127
  Bottom 0.406: V1.7 65.26,33.62 65.26,27.46 67.59,25.12 71.1,25.12 72.01,24.21 75.11,24.21 75.52,23.8 77.55,23.8 78.08,23.27 L19.1
N$128
  Bottom 0.406: L12.1 96.37,24.46 96.37,36.95 96.5,37.08 96.5,58.5 96.04,58.95 64.29,58.95 61.88,61.37 61.88,64.26 61.42,63.8 52.28,63.8 52.16,63.69 V1.1
N$129  (1 unrouted)
VCC  (25 unrouted)